# Altium schematic sheet power_backup.SchDoc
size A; SheetNumber: 3; SheetTotal: 3
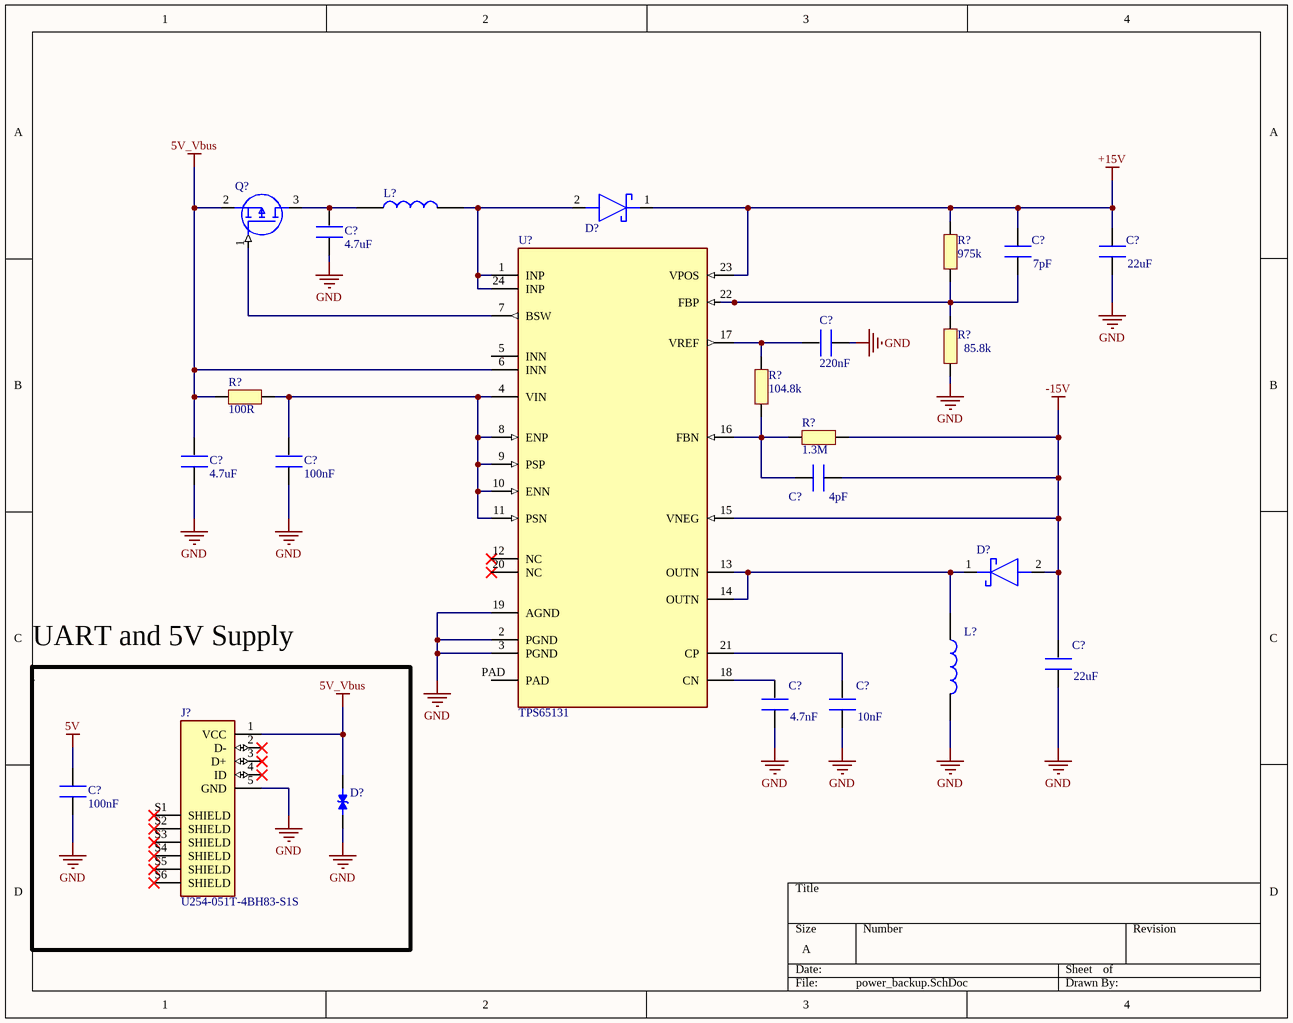
[diagram p0: power_backup.SchDoc]

## Parts
(Parts that share a designator on the sheet are numbered #1, #2 ... from top to bottom, then left to right.)
C?#1  7pF  [CAP_0603]
C?#2  22uF  [CAP_0603]
C?#3  4.7uF  [CAP_0603]
C?#4  220nF  [CAP_0603]
C?#5  4pF  [CAP_0603]
C?#6  4.7uF  [CAP_0603]
C?#7  100nF  [CAP_0603]
C?#8  22uF  [CAP_0603]
C?#9  4.7nF  [CAP_0603]
C?#10  10nF  [CAP_0603]
C?#11  100nF  [CAP_0805]
D?#1  BAS3010S02LRHE6327XTSA1  [BAS3010S02LRHE6327XTSA1]  (value not drawn)
D?#2  BAS3010S02LRHE6327XTSA1  [BAS3010S02LRHE6327XTSA1]  (value not drawn)
D?#3  LESD5D5.0CT1G  (value not drawn)
J?  U254-051T-4BH83-S1S  [USB_TypeMicro]
L?#1  SWPA4030S4R7MT  [Inductor_4.7uH]  (value not drawn)
L?#2  SWPA4030S4R7MT  [Inductor_4.7uH]  (value not drawn)
Q?  SI2323DS-T1-GE3  [SOT95P237X112-3N]  (value not drawn)
R?#1  975k  [RES_0603]
R?#2  85.8k  [RES_0603]
R?#3  100R  [RES_0603]
R?#4  104.8k  [RES_0603]
R?#5  1.3M  [RES_0603]
U?  TPS65131  [TPS65131RGER]

## Nets
5V: C?#11.2
5V_Vbus: C?#6.2 D?#3.2 J?.1(VCC) Q?.2(S) R?#3.1 U?.6(INN)
+15V: C?#1.1 C?#2.1 D?#1.1(K) R?#1.2 U?.23(VPOS)
-15V: C?#5.2 C?#8.2 D?#2.2(A) R?#5.1 U?.15(VNEG)
GND: C?#2.2 C?#3.1 C?#4.1 C?#6.1 C?#7.1 C?#8.1 C?#9.1 C?#10.1 C?#11.1 D?#3.1 J?.5(GND) L?#2.2 R?#2.1 U?.2(PGND) U?.3(PGND) U?.19(AGND)
NetC?#1_2: C?#1.2 R?#1.1 R?#2.2 U?.22(FBP)
NetC?#3_2: C?#3.2 L?#1.1 Q?.3(D)
NetC?#4_2: C?#4.2 R?#4.2 U?.17(VREF)
NetC?#5_1: C?#5.1 R?#4.1 R?#5.2 U?.16(FBN)
NetC?#7_2: C?#7.2 R?#3.2 U?.4(VIN) U?.8(ENP) U?.9(PSP) U?.10(ENN) U?.11(PSN)
NetC?#9_2: C?#9.2 U?.18(CN)
NetC?#10_2: C?#10.2 U?.21(CP)
NetD?#1_2: D?#1.2(A) L?#1.2 U?.1(INP) U?.24(INP)
NetD?#2_1: D?#2.1(K) L?#2.1 U?.13(OUTN) U?.14(OUTN)
NetQ?_1: Q?.1(G) U?.7(BSW)

Not connected (* = marked no-connect by the designer): J? 2(D-)* 3(D+)* 4(ID)* S1(SHIELD)* S2(SHIELD)* S3(SHIELD)* S4(SHIELD)* S5(SHIELD)* S6(SHIELD)*; U? 5(INN) 12(NC)* 20(NC)* PAD

## Notes on the sheet
- UART and 5V Supply

## Library data of the parts
C?#1-C?#10 = Cap_0603: Capacitor SMD 0603 Generic
C?#11 = Cap_0805: Capacitor SMD 0805 Generic
D?#1 D?#2 = BAS3010S02LRHE6327XTSA1: Schottky Diode; Manufacturer_Name: Infineon; Datasheet Link: https://componentsearchengine.com/Datasheets/2/BAS3010S02LRHE6327XTSA1.pdf; Height: 0.4mm; Manufacturer_Part_Number: BAS3010S02LRHE6327XTSA1; Mouser Part Number: 726-3010S02LRHXTSA1; Mouser Price/Stock: https://www.mouser.co.uk/ProductDetail/Infineon-Technologies/BAS3010S02LRHE6327XTSA1?qs=K00xGehIljugyKIwqYK2hw%3D%3D; Arrow Part Number: BAS3010S02LRHE6327XTSA1; Arrow Price/Stock: https://www.arrow.com/en/products/bas3010s02lrhe6327xtsa1/infineon-technologies-ag?region=nac
D?#3 = TVSDiode: SOD-523 ESD Protection Devices ROHS / VRWM = 5V / VC = 11.6V / C = 15pF General Purpose speed
J? = USB_TypeMicro: 1.8A USB 2.0 1 260℃ Surface Mount 5P Female -20℃~+85℃ Gold Copper Alloy Micro-B SMD USB Connectors ROHS
L?#1 L?#2 = Inductor_4.7uH: Wire Wound SMD Power Inductors  SWPA Series / 2A 4.7uH ±20% 3.2A SMD Power Inductors ROHS
Q? = SI2323DS-T1-GE3: MOSFET (P-Channel); Manufacturer_Name: Vishay; Datasheet Link: https://mouser.componentsearchengine.com/Datasheets/2/SI2323DS-T1-GE3.pdf; Height: 1.12mm; Manufacturer_Part_Number: SI2323DS-T1-GE3; Mouser Part Number: 781-SI2323DS-T1-GE3; Mouser Price/Stock: https://www.mouser.co.uk/ProductDetail/Vishay-Semiconductors/SI2323DS-T1-GE3?qs=IRuQNBqMOcnPRxUlCX6ywQ%3D%3D; Arrow Part Number: SI2323DS-T1-GE3; Arrow Price/Stock: https://www.arrow.com/en/products/si2323ds-t1-ge3/vishay?region=nac
R?#1-R?#5 = Res_0603: Resistor SMD 0603 Generic
U? = TPS65131RGER: Split-Rail Converter with Dual, Positive and Negative Outputs (750mA typ)